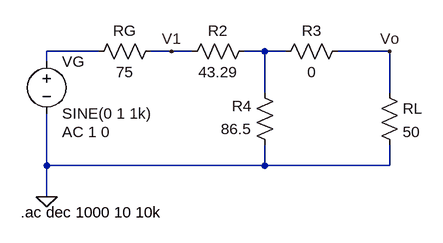
[diagram p0: schematic Ex12.asc]
Ex12.asc, the LTspice schematic file:
Version 4
SHEET 1 880 680
WIRE 128 112 48 112
WIRE 240 112 208 112
WIRE 272 112 240 112
WIRE 384 112 352 112
WIRE 416 112 384 112
WIRE 576 112 496 112
WIRE 48 128 48 112
WIRE 384 176 384 112
WIRE 576 176 576 112
WIRE 48 288 48 208
WIRE 384 288 384 256
WIRE 384 288 48 288
WIRE 576 288 576 256
WIRE 576 288 384 288
WIRE 48 336 48 288
FLAG 48 336 0
FLAG 576 112 Vo
FLAG 240 112 V1
SYMBOL voltage 48 112 R0
WINDOW 123 24 124 Left 2
WINDOW 39 0 0 Left 0
SYMATTR InstName VG
SYMATTR Value SINE(0 1 1k)
SYMATTR Value2 AC 1 0
SYMBOL res 224 96 R90
WINDOW 0 0 56 VBottom 2
WINDOW 3 32 56 VTop 2
SYMATTR InstName RG
SYMATTR Value 75
SYMBOL res 368 96 R90
WINDOW 0 0 56 VBottom 2
WINDOW 3 32 56 VTop 2
SYMATTR InstName R2
SYMATTR Value 43.29
SYMBOL res 512 96 R90
WINDOW 0 0 56 VBottom 2
WINDOW 3 32 56 VTop 2
SYMATTR InstName R3
SYMATTR Value 0
SYMBOL res 400 272 R180
WINDOW 0 36 76 Left 2
WINDOW 3 36 40 Left 2
SYMATTR InstName R4
SYMATTR Value 86.5
SYMBOL res 560 160 R0
SYMATTR InstName RL
SYMATTR Value 50
TEXT 8 360 Left 2 !.ac dec 1000 10 10k

The netlist it stands for:
* Ex12.asc
VG N001 0 SINE(0 1 1k) AC 1 0
RG V1 N001 75
R2 N002 V1 43.29
R3 Vo N002 0
R4 0 N002 86.5
RL Vo 0 50
.ac dec 1000 10 10k
.backanno
.end